# EAGLE design ecg_board (EAGLE 9.6.2)
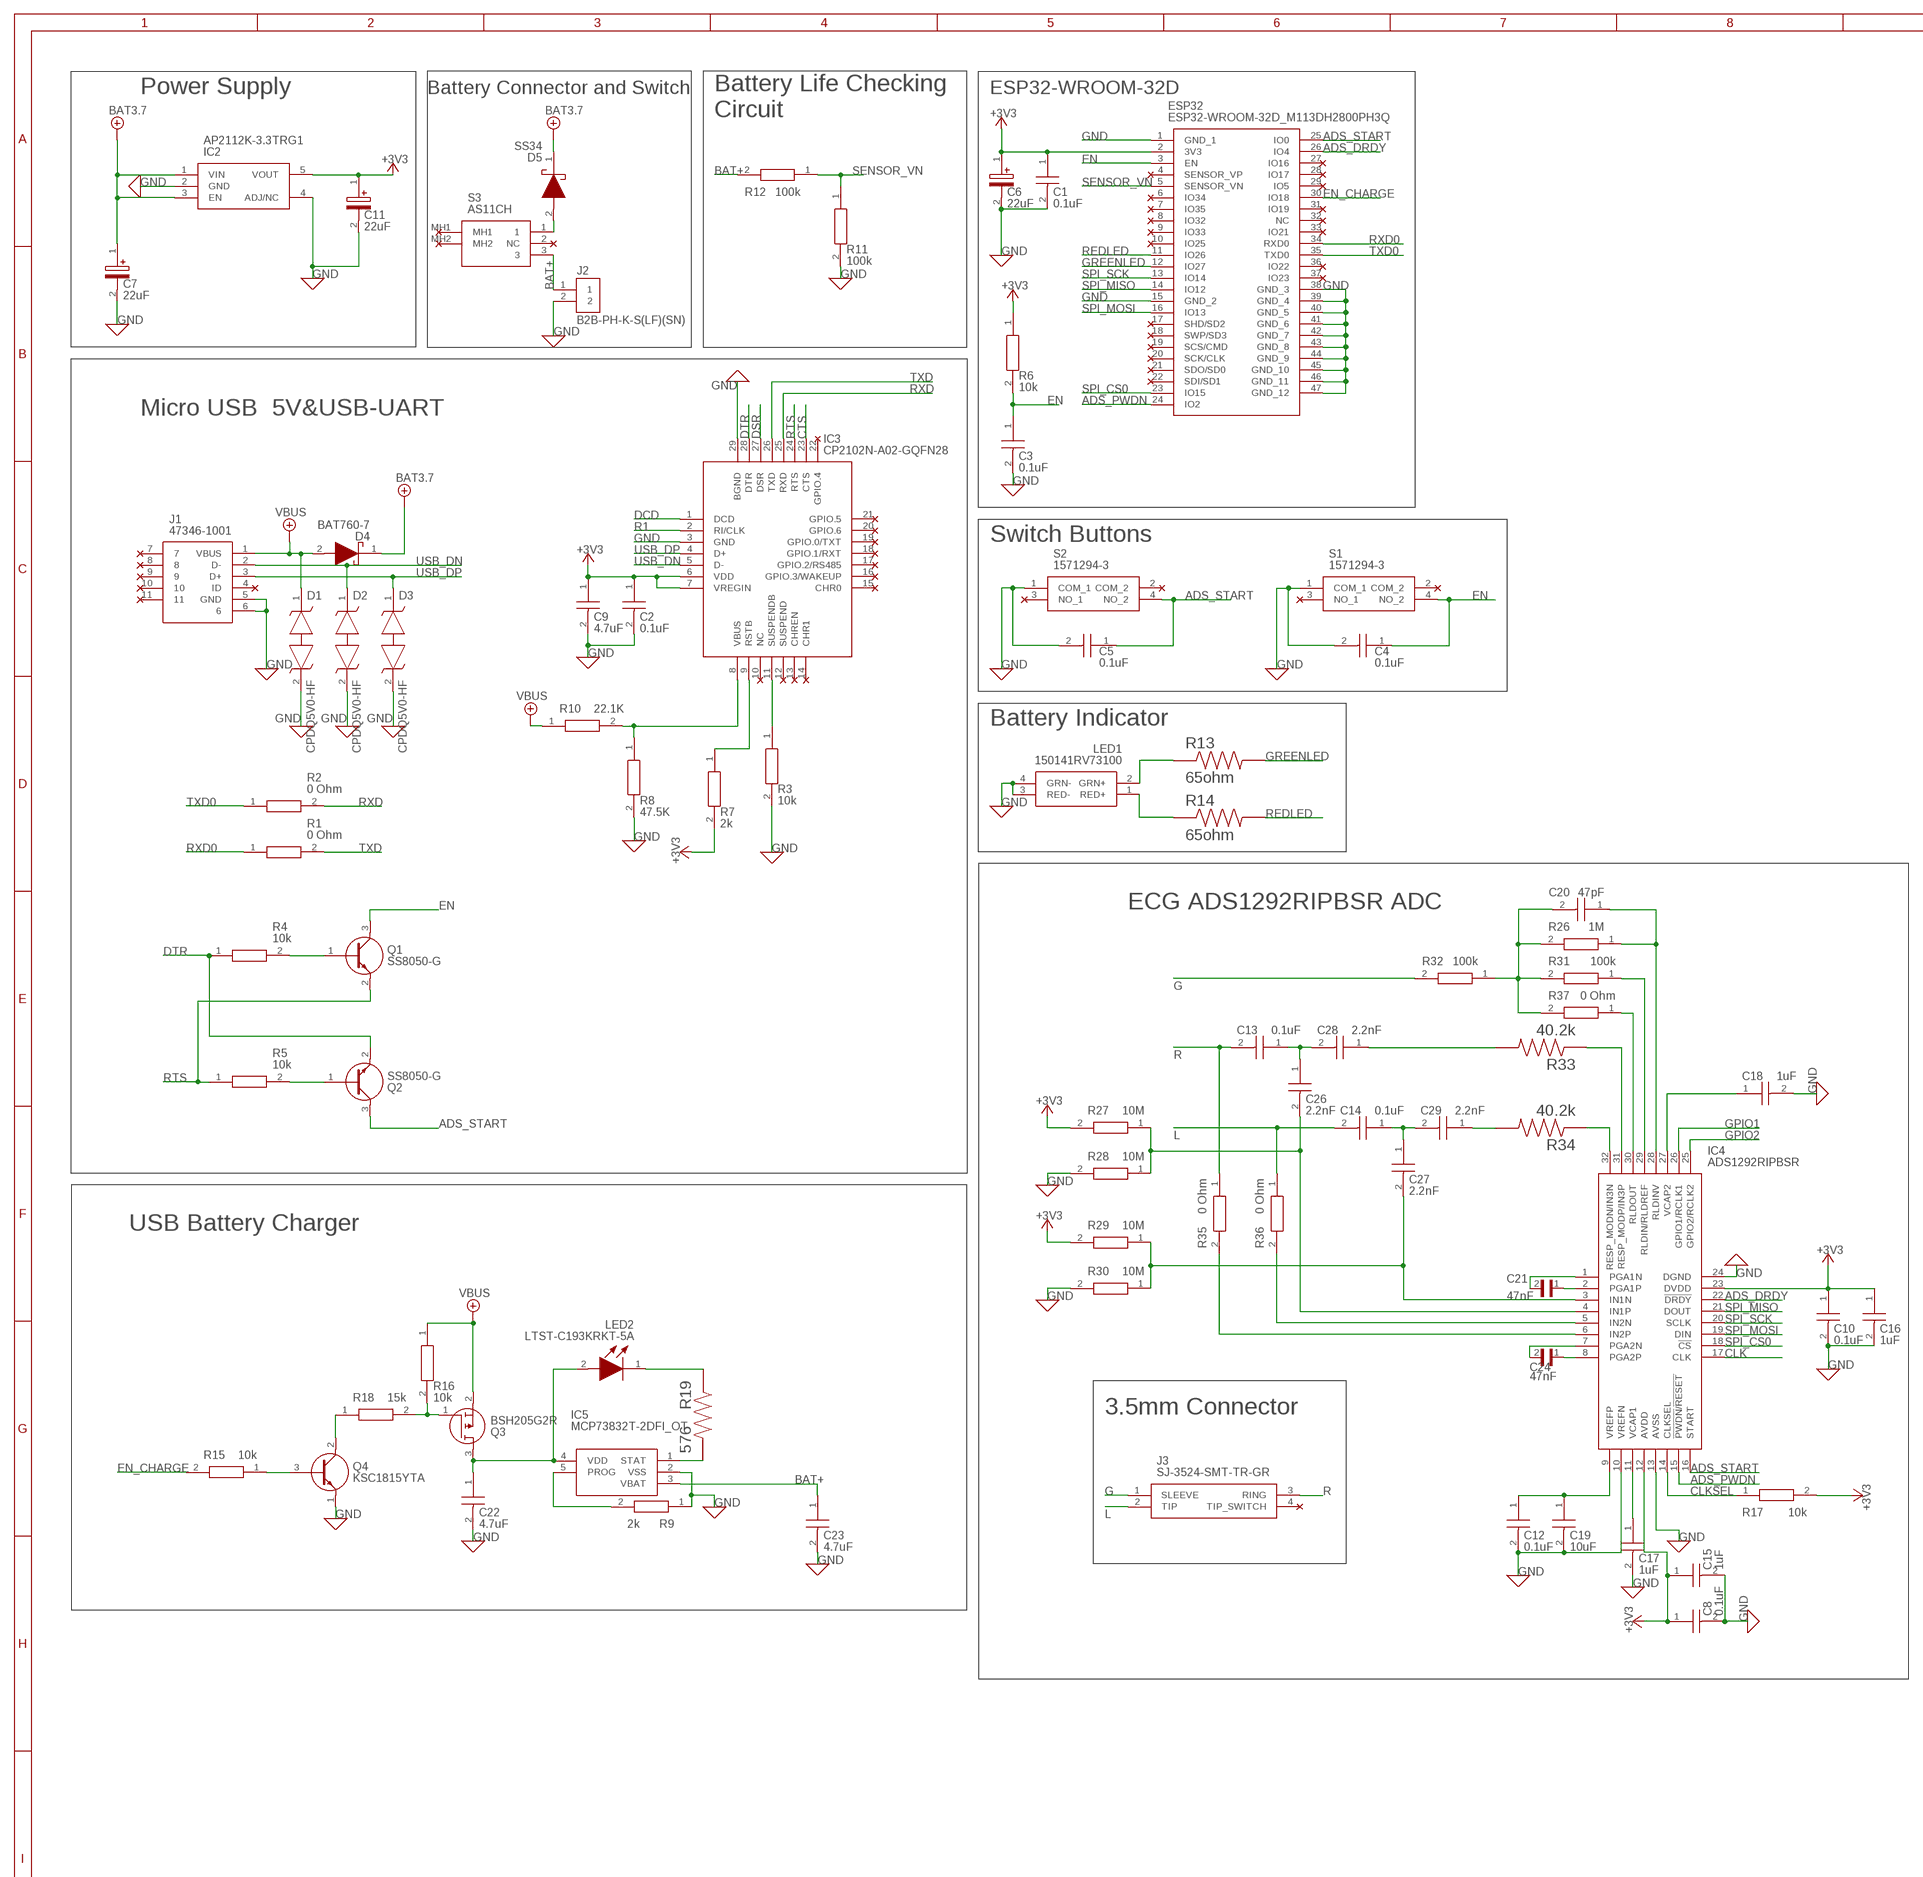
[diagram p0: schematic, sheet 1, part 1 of 2]
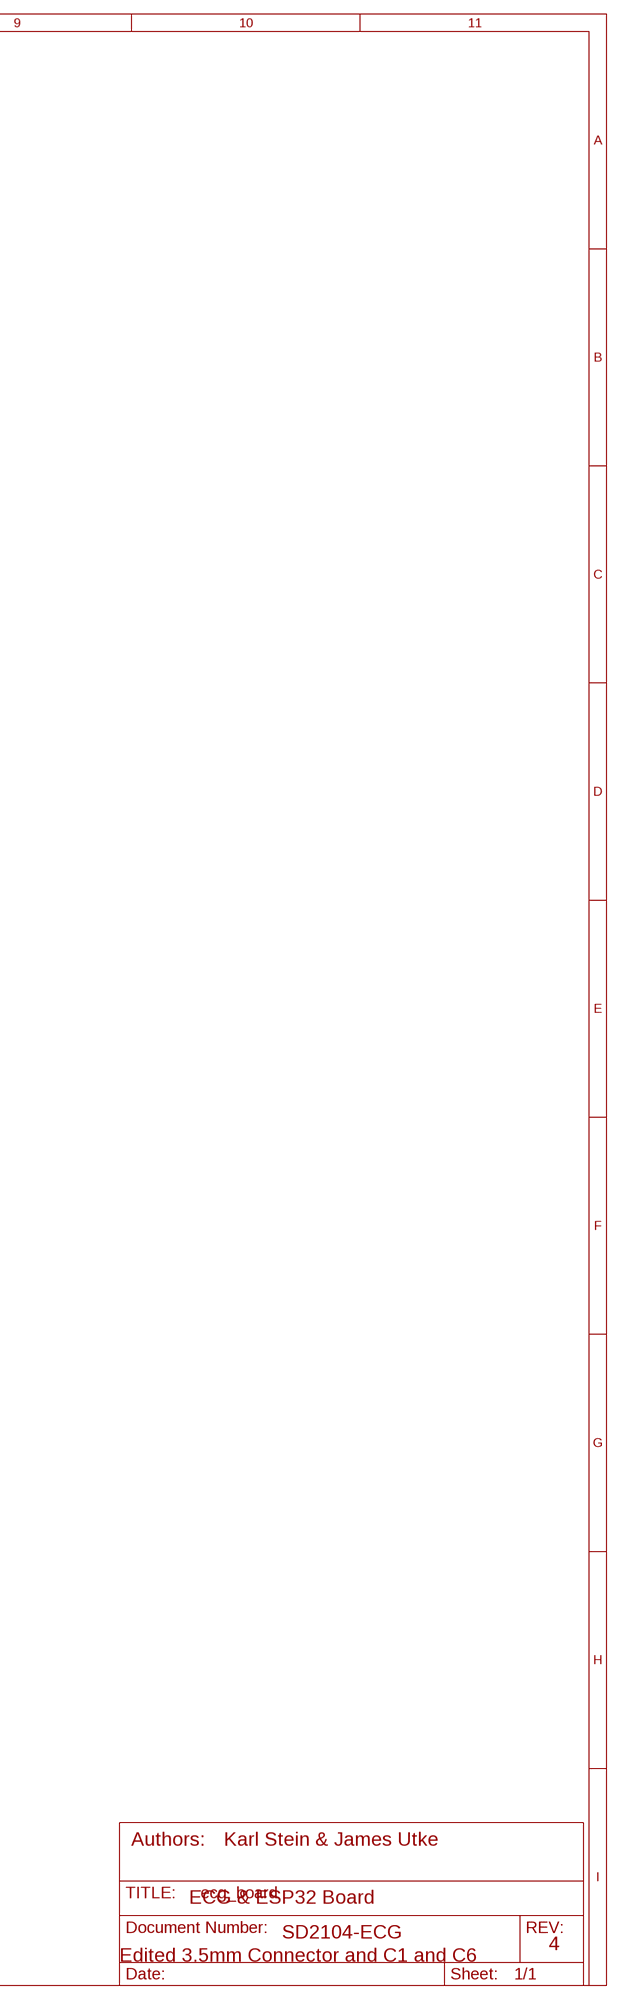
[diagram p1: schematic, sheet 1, part 2 of 2]

## Parts
C1  0.1uF  C0805C104K5RAC7411  [CAPC2012X88N]
C2  0.1uF  C0805C104K5RAC7411  [CAPC2012X88N]
C3  0.1uF  C0805C104K5RAC7411  [CAPC2012X88N]
C4  0.1uF  C0805C104K5RAC7411  [CAPC2012X88N]
C5  0.1uF  C0805C104K5RAC7411  [CAPC2012X88N]
C6  22uF  F381A226MMAAXE  [CAPPC1609X90N]
C7  22uF  F381A226MMAAXE  [CAPPC1609X90N]
C8  0.1uF  C0805C104K5RAC7411  [CAPC2012X88N]
C9  4.7uF  JMK212B7475KGHT  [CAPC2114X145N]
C10  0.1uF  C0805C104K5RAC7411  [CAPC2012X88N]
C11  22uF  F381A226MMAAXE  [CAPPC1609X90N]
C12  0.1uF  C0805C104K5RAC7411  [CAPC2012X88N]
C13  0.1uF  C0805C104K5RAC7411  [CAPC2012X88N]
C14  0.1uF  C0805C104K5RAC7411  [CAPC2012X88N]
C15  1uF  C0805X105K8RAC7210  [CAPC2012X100N]
C16  1uF  C0805X105K8RAC7210  [CAPC2012X100N]
C17  1uF  C0805X105K8RAC7210  [CAPC2012X100N]
C18  1uF  C0805X105K8RAC7210  [CAPC2012X100N]
C19  10uF  TMK212BBJ106MGHT  [CAPC2012X135N]
C20  47pF  CBR08C470J5GAC  [CAPC2012X95N]
C21  47nF  C0805C473K1RECAUTO  [CAPC2012X140N]
C22  4.7uF  JMK212B7475KGHT  [CAPC2114X145N]
C23  4.7uF  JMK212B7475KGHT  [CAPC2114X145N]
C24  47nF  C0805C473K1RECAUTO  [CAPC2012X140N]
C26  2.2nF  C0805J222K1RACAUTO  [CAPC2012X100N]
C27  2.2nF  C0805J222K1RACAUTO  [CAPC2012X100N]
C28  2.2nF  C0805J222K1RACAUTO  [CAPC2012X100N]
C29  2.2nF  C0805J222K1RACAUTO  [CAPC2012X100N]
D1  CPDQ5V0-HF  [SODFL1006X40N]
D2  CPDQ5V0-HF  [SODFL1006X40N]
D3  CPDQ5V0-HF  [SODFL1006X40N]
D4  BAT760-7  [SOD2513X120N]
D5  SS34  [DIOM8059X256N]
ESP32  ESP32-WROOM-32D_M113DH2800PH3Q  [ESP32WROOM32DM113DH2800PH3Q0]
IC2  AP2112K-3.3TRG1  [SOT95P282X130-5N]
IC3  CP2102N-A02-GQFN28  [QFN50P500X500X80-29N]
IC4  ADS1292RIPBSR  [QFP50P700X700X120-32N]
IC5  MCP73832T-2DFI_OT  [SOT95P270X145-5N]
J1  47346-1001  [473461001]
J2  B2B-PH-K-S(LF)(SN)  [JST_B2B-PH-K-S(LF)(SN)]
J3  SJ-3524-SMT-TR-GR  [SJ3524SMTTRGR]
LED1  150141RV73100  [SMD3528_1]
LED2  LTST-C193KRKT-5A  [LEDC1608X45N]
Q1  SS8050-G  [SOT95P240X115-3N]
Q2  SS8050-G  [SOT95P240X115-3N]
Q3  BSH205G2R  [SOT95P230X110-3N]
Q4  KSC1815YTA  [BC33740TA]
R1  0 Ohm  CR0603AJ_-000ELF  [RESC1608X55N]
R2  0 Ohm  CR0603AJ_-000ELF  [RESC1608X55N]
R3  10k  HV73V1JTTD103J  [CAPC1608X55N]
R4  10k  HV73V1JTTD103J  [CAPC1608X55N]
R5  10k  HV73V1JTTD103J  [CAPC1608X55N]
R6  10k  HV73V1JTTD103J  [CAPC1608X55N]
R7  2k  ERJ-UP3F2001V  [RESC1608X55N]
R8  47.5K  ERJ-UP3F4752V  [RESC1608X55N]
R9  2k  ERJ-UP3F2001V  [RESC1608X55N]
R10  22.1K  ERJ-2RHD2212X  [RESC1005X40N]
R11  100k  RCG0603100KJNEA  [RESC1608X50N]
R12  100k  RCG0603100KJNEA  [RESC1608X50N]
R13  65ohm  Y402265R0000A9W  [RESC2012X64N]
R14  65ohm  Y402265R0000A9W  [RESC2012X64N]
R15  10k  HV73V1JTTD103J  [CAPC1608X55N]
R16  10k  HV73V1JTTD103J  [CAPC1608X55N]
R17  10k  HV73V1JTTD103J  [CAPC1608X55N]
R18  15k  CRCW080515K0FKEBC  [RESC2012X60N]
R19  576  CRCW0805576RFKEA  [RESC2012X50N]
R26  1M  HV731JTTD105J  [RESC1608X55N]
R27  10M  CRCW060310M0JNEAC  [RESC1608X55N]
R28  10M  CRCW060310M0JNEAC  [RESC1608X55N]
R29  10M  CRCW060310M0JNEAC  [RESC1608X55N]
R30  10M  CRCW060310M0JNEAC  [RESC1608X55N]
R31  100k  RCG0603100KJNEA  [RESC1608X50N]
R32  100k  RCG0603100KJNEA  [RESC1608X50N]
R33  40.2k  RMCF1206FT40K2  [RESC3216X70N]
R34  40.2k  RMCF1206FT40K2  [RESC3216X70N]
R35  0 Ohm  CR0603AJ_-000ELF  [RESC1608X55N]
R36  0 Ohm  CR0603AJ_-000ELF  [RESC1608X55N]
R37  0 Ohm  CR0603AJ_-000ELF  [RESC1608X55N]
S1  1571294-3  [15712943]
S2  1571294-3  [15712943]
S3  AS11CH  [AS11CH]

## Nets
+3V3: C1.1 C2.1 C6.1(+) C8.1 C9.1 C10.1 C11.1(+) C15.1 C16.1 ESP32.2(3V3) IC2.5(VOUT) IC3.6(VDD) IC3.7(VREGIN) IC4.12(AVDD) IC4.23(DVDD) R6.1 R7.2 R17.2 R27.2 R29.2
+5V: C7.1(+) D4.1(K) D5.1(K) IC2.1(VIN) IC2.3(EN) ; supply symbol labelled BAT3.7
+5V/1: D1.1 D4.2(A) J1.1(VBUS) Q3.2(S) R10.1 R16.1 ; supply symbol labelled VBUS
ADS_DRDY: ESP32.26(IO4) IC4.22(!DRDY)
ADS_PWDN: ESP32.24(IO2) IC4.15(!PWDN!/!RESET)
ADS_START: C5.1 ESP32.25(IO0) IC4.16(START) Q2.3(C) S2.4(NO_2)
BAT+: C23.1 IC5.3(VBAT) J2.1 R12.2 S3.3
CLK: IC4.17(CLK)
CLKSEL: IC4.14(CLKSEL) R17.1
CTS: IC3.23(CTS)
DCD: IC3.1(DCD)
DSR: IC3.27(DSR)
DTR: IC3.28(DTR) Q2.2(E) R4.1
EN: C3.1 C4.1 ESP32.3(EN) Q1.3(C) R6.2 S1.4(NO_2)
EN_CHARGE: ESP32.30(IO18) R15.2
G: J3.1(SLEEVE) R32.2
GND: C1.2 C2.2 C3.2 C4.2 C5.2 C6.2(-) C7.2(-) C8.2 C9.2 C10.2 C11.2(-) C12.2 C15.2 C16.2 C17.2 C18.2 C19.2 C22.2 C23.2 D1.2 D2.2 D3.2 ESP32.1(GND_1) ESP32.15(GND_2) ESP32.38(GND_3) ESP32.39(GND_4) ESP32.40(GND_5) ESP32.41(GND_6) ESP32.42(GND_7) ESP32.43(GND_8) ESP32.44(GND_9) ESP32.45(GND_10) ESP32.46(GND_11) ESP32.47(GND_12) IC2.2(GND) IC2.4(ADJ/NC) IC3.3(GND) IC3.29(BGND) IC4.10(VREFN) IC4.13(AVSS) IC4.24(DGND) IC5.2(VSS) J1.5(GND) J1.6 J2.2 LED1.3(RED-) LED1.4(GRN-) Q4.1(E) R3.2 R8.2 R9.1 R11.2 R28.2 R30.2 S1.1(COM_1) S2.1(COM_1)
GPIO1: IC4.26(GPIO1/RCLK1)
GPIO2: IC4.25(GPIO2/RCLK2)
GREENLED: ESP32.12(IO27) R13.2
L: C14.2 J3.2(TIP) R36.1
N$1: LED1.2(GRN+) R13.1
N$2: LED1.1(RED+) R14.1
N$3: C12.1 C19.1 IC4.9(VREFP)
N$4: Q1.1(B) R4.2
N$5: Q2.1(B) R5.2
N$6: C17.1 IC4.11(VCAP1)
N$7: C18.1 IC4.27(VCAP2)
N$8: LED2.1(K) R19.1
N$9: IC4.32(RESP_MODN/IN3N) R34.1
N$10: D5.2(A) S3.1
N$11: IC5.5(PROG) R9.2
N$12: Q4.3(B) R15.1
N$13: IC4.31(RESP_MODP/IN3P) R33.1
N$14: Q4.2(C) R18.1
N$15: C29.1 R34.2
N$16: IC3.11(SUSPENDB) R3.1
N$17: IC3.9(RSTB) R7.1
N$18: IC3.8(VBUS) R8.1 R10.2
N$20: C14.1 C27.1 C29.2
N$21: C13.1 C26.1 C28.2
N$22: C28.1 R33.2
N$23: IC4.5(IN2N) R36.2
N$24: IC4.6(IN2P) R35.2
N$25: Q3.1(G) R16.2 R18.2
N$26: IC5.1(STAT) R19.2
N$27: C20.2 R26.2 R31.2 R32.1 R37.2
N$28: C22.1 IC5.4(VDD) LED2.2(A) Q3.3(D)
N$42: C21.1 IC4.2(PGA1P)
N$44: C21.2 IC4.1(PGA1N)
N$46: C27.2 IC4.3(IN1N) R29.1 R30.1
N$47: C26.2 IC4.4(IN1P) R27.1 R28.1
N$48: C24.1 IC4.8(PGA2P)
N$49: C24.2 IC4.7(PGA2N)
N$56: IC4.29(RLDIN/RLDREF) R31.1
N$57: IC4.30(RLDOUT) R37.1
N$59: C20.1 IC4.28(RLDINV) R26.1
R: C13.2 J3.3(RING) R35.1
R1: IC3.2(RI/CLK)
REDLED: ESP32.11(IO26) R14.2
RTS: IC3.24(RTS) Q1.2(E) R5.1
RXD: IC3.25(RXD) R2.2
RXD0: ESP32.34(RXD0) R1.1
SENSOR_VN: ESP32.5(SENSOR_VN) R11.1 R12.1
SPI_CS0: ESP32.23(IO15) IC4.18(!CS)
SPI_MISO: ESP32.14(IO12) IC4.21(DOUT)
SPI_MOSI: ESP32.16(IO13) IC4.19(DIN)
SPI_SCK: ESP32.13(IO14) IC4.20(SCLK)
TXD: IC3.26(TXD) R1.2
TXD0: ESP32.35(TXD0) R2.1
USB_DN: D2.1 IC3.5(D-) J1.2(D-)
USB_DP: D3.1 IC3.4(D+) J1.3(D+)
Unconnected: ESP32.4(SENSOR_VP) ESP32.6(IO34) ESP32.7(IO35) ESP32.8(IO32) ESP32.9(IO33) ESP32.10(IO25) ESP32.17(SHD/SD2) ESP32.18(SWP/SD3) ESP32.19(SCS/CMD) ESP32.20(SCK/CLK) ESP32.21(SDO/SD0) ESP32.22(SDI/SD1) ESP32.27(IO16) ESP32.28(IO17) ESP32.29(IO5) ESP32.31(IO19) ESP32.32(NC) ESP32.33(IO21) ESP32.36(IO22) ESP32.37(IO23) IC3.10(NC) IC3.12(SUSPEND) IC3.13(CHREN) IC3.14(CHR1) IC3.15(CHR0) IC3.16(GPIO.3/WAKEUP) IC3.17(GPIO.2/RS485) IC3.18(GPIO.1/RXT) IC3.19(GPIO.0/TXT) IC3.20(GPIO.6) IC3.21(GPIO.5) IC3.22(GPIO.4) J1.4(ID) J1.7 J1.8 J1.9 J1.10 J1.11 J3.4(TIP_SWITCH) S1.2(COM_2) S1.3(NO_1) S2.2(COM_2) S2.3(NO_1) S3.2(NC) S3.MH1 S3.MH2

## Notes on the sheet
- Power Supply | Battery Connector and Switch | ESP32-WROOM-32D
- Battery Life Checking 
  Circuit
- Micro USB  5V&USB-UART
- Switch Buttons
- Battery Indicator
- ECG ADS1292RIPBSR ADC
- USB Battery Charger
- 3.5mm Connector
- Authors: | Karl Stein & James Utke
- ECG & ESP32 Board
- SD2104-ECG
- 4
- Edited 3.5mm Connector and C1 and C6

## Library data of the parts
C1-C5 C8 C10 C12-C14 = SamacSys_Parts:C0805C104K5RAC7411: Cap Ceramic 0.1uF 50V X7R 10% Pad SMD 0805 125C T/R Source: Datasheet; DESCRIPTION: Cap Ceramic 0.1uF 50V X7R 10% Pad SMD 0805 125C T/R; HEIGHT: 0.88mm; MANUFACTURER_NAME: Kemet; MANUFACTURER_PART_NUMBER: C0805C104K5RAC7411; MOUSER_PART_NUMBER: 80-C0805C104K5RACLR; MOUSER_PRICE-STOCK: https://www.mouser.co.uk/ProductDetail/KEMET/C0805C104K5RAC7411/?qs=jbRM9o5BbzPcVXF0wW9AYg%3D%3D
C6 C7 C11 = SamacSys_Parts:F381A226MMAAXE: 22uF F38 Series Conductive Polymer, Miniature, Undertab Solid Electrolytic Chip Capacitors Source: Datasheet <https://componentsearchengine.com/Datasheets/1/F381A226MMAAXE.pdf>; DESCRIPTION: 22uF F38 Series Conductive Polymer, Miniature, Undertab Solid Electrolytic Chip Capacitors; HEIGHT: 0.9mm; MANUFACTURER_NAME: AVX; MANUFACTURER_PART_NUMBER: F381A226MMAAXE; MOUSER_PART_NUMBER: 581-F381A226MMAAXE; MOUSER_PRICE-STOCK: https://www.mouser.co.uk/ProductDetail/AVX/F381A226MMAAXE?qs=gTYE2QTfZfQFi8JvXKXiKg%3D%3D
C9 C22 C23 = SamacSys_Parts:JMK212B7475KGHT: Taiyo Yuden JMK212B7475KGHT 4.7F MLCC 6.3V dc +/-10% Tolerance SMD Source: Datasheet; DESCRIPTION: Taiyo Yuden JMK212B7475KGHT 4.7F MLCC 6.3V dc +/-10% Tolerance SMD; HEIGHT: 1.45mm; MANUFACTURER_NAME: TAIYO YUDEN; MANUFACTURER_PART_NUMBER: JMK212B7475KGHT; MOUSER_PART_NUMBER: 963-JMK212B7475KGHT; MOUSER_PRICE-STOCK: https://www.mouser.co.uk/ProductDetail/Taiyo-Yuden/JMK212B7475KGHT/?qs=vmHwEFxEFR9NgetR%2FORAvw%3D%3D
C15-C18 = SamacSys_Parts:C0805X105K8RAC7210: Multilayer Ceramic Capacitors MLCC - SMD/SMT 10V 1uF X7R 0805 10% Flex Source: Datasheet; DESCRIPTION: Multilayer Ceramic Capacitors MLCC - SMD/SMT 10V 1uF X7R 0805 10% Flex; HEIGHT: 1mm; MANUFACTURER_NAME: Kemet; MANUFACTURER_PART_NUMBER: C0805X105K8RAC7210; MOUSER_PART_NUMBER: 80-C0805X105K8RACLR; MOUSER_PRICE-STOCK: https://www.mouser.co.uk/ProductDetail/KEMET/C0805X105K8RAC7210?qs=ds50AKTGxA8Ac4j4qbsB5A%3D%3D
C19 = SamacSys_Parts:TMK212BBJ106MGHT: Multilayer Ceramic Capacitors MLCC - SMD/SMT CAP ,MLCC ,0805,25V ,X5R,10uF 20% ,T&R Source: Datasheet <https://componentsearchengine.com/Datasheets/1/TMK212BBJ106MGHT.pdf>; DESCRIPTION: Multilayer Ceramic Capacitors MLCC - SMD/SMT CAP ,MLCC ,0805,25V ,X5R,10uF 20% ,T&R; HEIGHT: 1.35mm; MANUFACTURER_NAME: TAIYO YUDEN; MANUFACTURER_PART_NUMBER: TMK212BBJ106MGHT; MOUSER_PART_NUMBER: 963-TMK212BBJ106MGHT; MOUSER_PRICE-STOCK: https://www.mouser.co.uk/ProductDetail/Taiyo-Yuden/TMK212BBJ106MGHT?qs=sBf%2Fb4nBSlfab8x4Ir6OCA%3D%3D
C20 = SamacSys_Parts:CBR08C470J5GAC: Multilayer Ceramic Capacitors MLCC - SMD/SMT 50V 47pF C0G 0805 5% Source: Datasheet <http://www.kemet.com/Lists/ProductCatalog/Attachments/490/KEM_C1030_CBR_SMD.pdf>; DESCRIPTION: Multilayer Ceramic Capacitors MLCC - SMD/SMT 50V 47pF C0G 0805 5%; HEIGHT: 0.95mm; MANUFACTURER_NAME: Kemet; MANUFACTURER_PART_NUMBER: CBR08C470J5GAC; MOUSER_PART_NUMBER: 80-CBR08C470J5GAC; MOUSER_PRICE-STOCK: https://www.mouser.co.uk/ProductDetail/KEMET/CBR08C470J5GAC?qs=3SGS%2FGl3GGxvjRSwA4%2FCFQ%3D%3D
C21 C24 = C0805C473K1RECAUTO:C0805C473K1RECAUTO; DESCRIPTION: CAP CER 0805 47NF 100V X7R 10%; DIGI-KEY_PART_NUMBER: 399-C0805C473K1RECAUTOCT-ND; MF: KEMET; MP: C0805C473K1RECAUTO; PACKAGE: 2012 KEMET; PURCHASE-URL: https://pricing.snapeda.com/search/part/C0805C473K1RECAUTO/?ref=eda
C26-C29 = SamacSys_Parts:C0805J222K1RACAUTO: Multilayer Ceramic Capacitors MLCC - SMD/SMT 100V 2200pF X7R AUTO 10% Open Mode Flex Source: Datasheet <https://4donline.ihs.com/images/VipMasterIC/IC/KEME/KEMES11130/KEMES11130-1.pdf?hkey=EF798316E3902B6ED9A73243A3159BB0>; DESCRIPTION: Multilayer Ceramic Capacitors MLCC - SMD/SMT 100V 2200pF X7R AUTO 10% Open Mode Flex; HEIGHT: 1mm; MANUFACTURER_NAME: Kemet; MANUFACTURER_PART_NUMBER: C0805J222K1RACAUTO; MOUSER_PART_NUMBER: 80-C0805J222K1RAUTO; MOUSER_PRICE-STOCK: https://www.mouser.co.uk/ProductDetail/KEMET/C0805J222K1RACAUTO?qs=ds50AKTGxA8FpM89MhHcBQ%3D%3D
D1-D3 = SamacSys_Parts:CPDQ5V0-HF: ESD Suppressors / TVS Diodes SMD ESD Diode 5V Bi-Direction Source: Datasheet <http://www.comchiptech.com/cms/UserFiles/CPDQ5V0-HF RevA825126.pdf>; DESCRIPTION: ESD Suppressors / TVS Diodes SMD ESD Diode 5V Bi-Direction; HEIGHT: 0.4mm; MANUFACTURER_NAME: Comchip Technology; MANUFACTURER_PART_NUMBER: CPDQ5V0-HF; MOUSER_PART_NUMBER: 750-CPDQ5V0-HF; MOUSER_PRICE-STOCK: https://www.mouser.co.uk/ProductDetail/Comchip-Technology/CPDQ5V0-HF/?qs=ccyN4P6STah119k8k5VB0Q%3D%3D
D4 = SamacSys_Parts:BAT760-7: Diode Schottky 30V 1A 2Pin SOD323 Diodes Inc BAT760-7, SMT Schottky Diode, 30V 1A, 2-Pin SOD-323 Source: Datasheet <https://www.diodes.com/assets/Datasheets/ds30498.pdf>; DESCRIPTION: Diode Schottky 30V 1A 2Pin SOD323 Diodes Inc BAT760-7, SMT Schottky Diode, 30V 1A, 2-Pin SOD-323; HEIGHT: 1.2mm; MANUFACTURER_NAME: Diodes Inc.; MANUFACTURER_PART_NUMBER: BAT760-7; MOUSER_PART_NUMBER: 621-BAT760-7; MOUSER_PRICE-STOCK: https://www.mouser.co.uk/ProductDetail/Diodes-Incorporated/BAT760-7?qs=JV7lzlMm3yKDDyO09xoRbQ%3D%3D
D5 = SamacSys_Parts:SS34: ON Semi SS34 SMT Schottky Diode, 40V 3A, 2-Pin DO-214AB Source: Datasheet <https://componentsearchengine.com/Datasheets/2/SS34.pdf>; DESCRIPTION: ON Semi SS34 SMT Schottky Diode, 40V 3A, 2-Pin DO-214AB; HEIGHT: 2.56mm; MANUFACTURER_NAME: ON Semiconductor; MANUFACTURER_PART_NUMBER: SS34; MOUSER_PART_NUMBER: 512-SS34; MOUSER_PRICE-STOCK: https://www.mouser.co.uk/ProductDetail/ON-Semiconductor-Fairchild/SS34?qs=2ONuHmP%2FXzb3ub11UdFfdQ%3D%3D
ESP32 = SamacSys_Parts:ESP32-WROOM-32D_M113DH2800PH3Q: WiFi Modules (802.11) SMD Module, ESP32-D0WD, 32Mbits SPI flash, UART mode, PCB antenna Source: Datasheet <https://www.espressif.com/sites/default/files/documentation/esp32-wroom-32d_esp32-wroom-32u_datasheet_en.pdf>; DESCRIPTION: WiFi Modules (802.11) SMD Module, ESP32-D0WD, 32Mbits SPI flash, UART mode, PCB antenna; HEIGHT: 3.2mm; MANUFACTURER_NAME: Espressif Systems; MANUFACTURER_PART_NUMBER: ESP32-WROOM-32D(M113DH2800PH3Q0); MOUSER_PART_NUMBER: 356-ES32WROOM32D16MB; MOUSER_PRICE-STOCK: https://www.mouser.co.uk/ProductDetail/Espressif-Systems/ESP32-WROOM-32DM113DH2800PH3Q0/?qs=W%2FMpXkg%252BdQ75%2Fda1rSxxJw%3D%3D
IC2 = SamacSys_Parts:AP2112K-3.3TRG1: 600mA 3.3V LDO Regulator Enable SOT23-5 DiodesZetex AP2112K-3.3TRG1, LDO Voltage Regulator, 3.3 V +/-1.5%, 2.5 6 Vin, 5-Pin SOT-23 Source: Datasheet; DESCRIPTION: 600mA 3.3V LDO Regulator Enable SOT23-5 DiodesZetex AP2112K-3.3TRG1, LDO Voltage Regulator, 3.3 V +/-1.5%, 2.5 6 Vin, 5-Pin SOT-23; HEIGHT: 1.3mm; MANUFACTURER_NAME: Diodes Inc.; MANUFACTURER_PART_NUMBER: AP2112K-3.3TRG1; MOUSER_PART_NUMBER: 621-AP2112K-3.3TRG1; MOUSER_PRICE-STOCK: https://www.mouser.co.uk/ProductDetail/Diodes-Incorporated/AP2112K-33TRG1/?qs=x6A8l6qLYDDPYHosCdzh%2FA%3D%3D
IC3 = SamacSys_Parts:CP2102N-A02-GQFN28: SILICON LABS - CP2102N-A02-GQFN28 - USB TO UART BRIDGE, -40 TO 85DEG C Source: Datasheet <https://componentsearchengine.com/Datasheets/2/CP2102N-A02-GQFN28.pdf>; DESCRIPTION: SILICON LABS - CP2102N-A02-GQFN28 - USB TO UART BRIDGE, -40 TO 85DEG C; HEIGHT: 0.8mm; MANUFACTURER_NAME: Silicon Labs; MANUFACTURER_PART_NUMBER: CP2102N-A02-GQFN28; MOUSER_PART_NUMBER: 634-CP2102NA02GQFN28; MOUSER_PRICE-STOCK: https://www.mouser.co.uk/ProductDetail/Silicon-Labs/CP2102N-A02-GQFN28/?qs=u16ybLDytRaSBkSkyjYFiA%3D%3D
IC4 = SamacSys_Parts:ADS1292RIPBSR: 2-Channel, 24-Bit Analog-To-Digital Converter w/Integrated Respiration Impedance and ECG Front End Source: Datasheet <http://www.ti.com/lit/gpn/ads1292r>; DESCRIPTION: 2-Channel, 24-Bit Analog-To-Digital Converter w/Integrated Respiration Impedance and ECG Front End; HEIGHT: 1.2mm; MANUFACTURER_NAME: Texas Instruments; MANUFACTURER_PART_NUMBER: ADS1292RIPBSR; MOUSER_PART_NUMBER: 595-ADS1292RIPBSR; MOUSER_PRICE-STOCK: https://www.mouser.co.uk/ProductDetail/Texas-Instruments/ADS1292RIPBSR?qs=i8JZjLRTtkKsg%252Br1%252BHF4jw%3D%3D
IC5 = SamacSys_Parts:MCP73832T-2DFI_OT: Battery Management 4.2V Li-Ion/Li-Poly Chrg mgnt controller Source: Datasheet <http://ww1.microchip.com/downloads/en/DeviceDoc/20001984g.pdf>; DESCRIPTION: Battery Management 4.2V Li-Ion/Li-Poly Chrg mgnt controller; HEIGHT: 1.45mm; MANUFACTURER_NAME: Microchip; MANUFACTURER_PART_NUMBER: MCP73832T-2DFI/OT; MOUSER_PART_NUMBER: 579-MCP73832T2DFI/OT; MOUSER_PRICE-STOCK: https://www.mouser.co.uk/ProductDetail/Microchip-Technology/MCP73832T-2DFI-OT?qs=Of9BA0M78V%2Fd7MaXZyVc5w%3D%3D
J1 = SamacSys_Parts:47346-1001: MOLEX - 47346-1001 - MULTIPOLE CONNECTOR Source: Datasheet <http://www.molex.com/webdocs/datasheets/pdf/en-us/0473461001_IO_CONNECTORS.pdf>; DESCRIPTION: MOLEX - 47346-1001 - MULTIPOLE CONNECTOR; HEIGHT: 2.94mm; MANUFACTURER_NAME: Molex; MANUFACTURER_PART_NUMBER: 47346-1001; MOUSER_PART_NUMBER: 538-47346-1001; MOUSER_PRICE-STOCK: https://www.mouser.co.uk/ProductDetail/Molex/47346-1001/?qs=yd8XiKYcH9muPqUKe4E0Dw%3D%3D
J2 = B2B-PH-K-S_LF__SN_:B2B-PH-K-S(LF)(SN): PH Series 2 Position 2 mm Pitch Through Hole Top Entry Shrouded Header; DESCRIPTION: Connector Header Through Hole 2 position 0.079 (2.00mm); DIGI-KEY_PART_NUMBER: 455-1704-ND; MF: JST Sales; MP: B2B-PH-K-S(LF)(SN); PACKAGE: None; PURCHASE-URL: https://pricing.snapeda.com/search/part/B2B-PH-K-S(LF)(SN)/?ref=eda
J3 = SamacSys_Parts:SJ-3524-SMT-TR-GR: CONN JACK STEREO 3.5MM SMD R/A Source: Datasheet <https://componentsearchengine.com/Datasheets/1/SJ-3524-SMT-TR-GR.pdf>; DESCRIPTION: CONN JACK STEREO 3.5MM SMD R/A; HEIGHT: 5mm; MANUFACTURER_NAME: CUI Inc.; MANUFACTURER_PART_NUMBER: SJ-3524-SMT-TR-GR; MOUSER_PART_NUMBER: 490-SJ3524-SMT-TR-GR; MOUSER_PRICE-STOCK: https://www.mouser.co.uk/ProductDetail/CUI-Devices/SJ-3524-SMT-TR-GR/?qs=WyjlAZoYn529WQTQrqdtvA%3D%3D
LED1 = SamacSys_Parts:150141RV73100: LED,Wurth Elektronik,150141RV73100 Wurth Elektronik 150141RV73100, WL-SBTW Series Bi-colour Green, Red LED, 572 / 625 nm 4-Pin 3528 (1411), Round Lens Source: Datasheet <https://componentsearchengine.com/Datasheets/2/150141RV73100.pdf>; DESCRIPTION: LED,Wurth Elektronik,150141RV73100 Wurth Elektronik 150141RV73100, WL-SBTW Series Bi-colour Green, Red LED, 572 / 625 nm 4-Pin 3528 (1411), Round Lens; HEIGHT: mm; MANUFACTURER_NAME: Wurth Elektronik; MANUFACTURER_PART_NUMBER: 150141RV73100; MOUSER_PART_NUMBER: 710-150141RV73100; MOUSER_PRICE-STOCK: https://www.mouser.co.uk/ProductDetail/Wurth-Elektronik/150141RV73100?qs=LlUlMxKIyB1w9QlMugtMLA%3D%3D
LED2 = SamacSys_Parts:LTST-C193KRKT-5A: Lite-On LTST-C193KRKT-5A, 631 nm Red LED, 1608 (0603) SMD package Source: Datasheet; DESCRIPTION: Lite-On LTST-C193KRKT-5A, 631 nm Red LED, 1608 (0603) SMD package; HEIGHT: 0.45mm; MANUFACTURER_NAME: Lite-On; MANUFACTURER_PART_NUMBER: LTST-C193KRKT-5A; MOUSER_PART_NUMBER: 859-LTSTC193KRKT5A; MOUSER_PRICE-STOCK: https://www.mouser.co.uk/ProductDetail/Lite-On/LTST-C193KRKT-5A/?qs=xIkB7y1OTor17kZSHyF5tQ%3D%3D
Q1 Q2 = SamacSys_Parts:SS8050-G: Bipolar Transistors - BJT NPN TRANSISTOR 1.5A 40V Source: Datasheet <http://www.comchiptech.com/admin/files/product/SS8050-G RevA181526.pdf>; DESCRIPTION: Bipolar Transistors - BJT NPN TRANSISTOR 1.5A 40V; HEIGHT: 1.15mm; MANUFACTURER_NAME: Comchip Technology; MANUFACTURER_PART_NUMBER: SS8050-G; MOUSER_PART_NUMBER: 750-SS8050-G; MOUSER_PRICE-STOCK: https://www.mouser.co.uk/ProductDetail/Comchip-Technology/SS8050-G/?qs=LLUE9lz1YbcHg%252BWLMAtcrQ%3D%3D
Q3 = SamacSys_Parts:BSH205G2R: MOSFET 20V P-channel Trench MOSFET Source: Datasheet <https://assets.nexperia.com/documents/data-sheet/BSH205G2.pdf>; DESCRIPTION: MOSFET 20V P-channel Trench MOSFET; HEIGHT: 1.1mm; MANUFACTURER_NAME: Nexperia; MANUFACTURER_PART_NUMBER: BSH205G2R; MOUSER_PART_NUMBER: 771-BSH205G2R; MOUSER_PRICE-STOCK: https://www.mouser.co.uk/ProductDetail/Nexperia/BSH205G2R?qs=%252BRKXB2WKlScNIfK4SlBmFA%3D%3D
Q4 = SamacSys_Parts:KSC1815YTA: Transistor, Fairchild, KSC1815YTA Source: Datasheet <https://www.onsemi.com/products/discretes-drivers/general-purpose-and-low-vcesat-transistors/ksc1815>; DESCRIPTION: Transistor, Fairchild, KSC1815YTA; HEIGHT: mm; MANUFACTURER_NAME: ON Semiconductor; MANUFACTURER_PART_NUMBER: KSC1815YTA; MOUSER_PART_NUMBER: 512-KSC1815YTA; MOUSER_PRICE-STOCK: https://www.mouser.co.uk/ProductDetail/ON-Semiconductor-Fairchild/KSC1815YTA?qs=ljbEvF4DwOP9FJQWOCoFLQ%3D%3D
R1 R2 R35-R37 = SamacSys_Parts:CR0603AJ_-000ELF: Thick Film Resistors - SMD ResA 0603 0R Jumper 100mW AEC-Q200 Source: Datasheet; DESCRIPTION: Thick Film Resistors - SMD ResA 0603 0R Jumper 100mW AEC-Q200; HEIGHT: 0.55mm; MANUFACTURER_NAME: Bourns; MANUFACTURER_PART_NUMBER: CR0603AJ/-000ELF; MOUSER_PART_NUMBER: 652-CR0603AJ/-000ELF; MOUSER_PRICE-STOCK: https://www.mouser.co.uk/ProductDetail/Bourns/CR0603AJ-000ELF/?qs=GedFDFLaBXF8EepoWODZMQ%3D%3D
R3-R6 R15-R17 = SamacSys_Parts:HV73V1JTTD103J: Thick Film Resistors - SMD 10000Ohms 5% 0603 TCR=100 AEC-Q200 Source: Datasheet; DESCRIPTION: Thick Film Resistors - SMD 10000Ohms 5% 0603 TCR=100 AEC-Q200; HEIGHT: 0.55mm; MANUFACTURER_NAME: KOA Speer; MANUFACTURER_PART_NUMBER: HV73V1JTTD103J; MOUSER_PART_NUMBER: 660-HV73V1JTTD103J; MOUSER_PRICE-STOCK: https://www.mouser.co.uk/ProductDetail/KOA-Speer/HV73V1JTTD103J?qs=xZ%2FP%252Ba9zWqbXuiWLWua7%2Fw%3D%3D
R7 R9 = SamacSys_Parts:ERJ-UP3F2001V: Anti-Sulfurated Thick Film Chip Resistors / Anti-Surge Type Source: Datasheet <https://industrial.panasonic.com/cdbs/www-data/pdf/RDP0000/AOA0000C337.pdf>; DESCRIPTION: Anti-Sulfurated Thick Film Chip Resistors / Anti-Surge Type; HEIGHT: 0.55mm; MANUFACTURER_NAME: Panasonic; MANUFACTURER_PART_NUMBER: ERJ-UP3F2001V
R8 = SamacSys_Parts:ERJ-UP3F4752V: Thick Film Resistors - SMD AEC-Q200 Source: Datasheet; DESCRIPTION: Thick Film Resistors - SMD AEC-Q200; HEIGHT: 0.55mm; MANUFACTURER_NAME: Panasonic; MANUFACTURER_PART_NUMBER: ERJ-UP3F4752V; MOUSER_PART_NUMBER: 667-ERJ-UP3F4752V; MOUSER_PRICE-STOCK: https://www.mouser.co.uk/ProductDetail/Panasonic/ERJ-UP3F4752V?qs=GedFDFLaBXGUd1E4zR%252BF8g%3D%3D
R10 = SamacSys_Parts:ERJ-2RHD2212X: Thick Film Resistors - SMD 0402 Resistor 0.5% 50ppm 22.1KOhm Source: Datasheet; DESCRIPTION: Thick Film Resistors - SMD 0402 Resistor 0.5% 50ppm 22.1KOhm; HEIGHT: 0.4mm; MANUFACTURER_NAME: Panasonic; MANUFACTURER_PART_NUMBER: ERJ-2RHD2212X; MOUSER_PART_NUMBER: 667-ERJ-2RHD2212X; MOUSER_PRICE-STOCK: https://www.mouser.co.uk/ProductDetail/Panasonic/ERJ-2RHD2212X?qs=pfd5qewlna6lhy494ElLrw%3D%3D
R11 R12 R31 R32 = SamacSys_Parts:RCG0603100KJNEA: RCG0603100KJNEA Source: Datasheet <https://componentsearchengine.com/Datasheets/1/RCG0603100KJNEA.pdf>; DESCRIPTION: RCG0603100KJNEA; HEIGHT: 0.5mm; MANUFACTURER_NAME: Vishay; MANUFACTURER_PART_NUMBER: RCG0603100KJNEA; MOUSER_PART_NUMBER: 71-RCG0603100KJNEA; MOUSER_PRICE-STOCK: https://www.mouser.com/Search/Refine.aspx?Keyword=71-RCG0603100KJNEA
R13 R14 = Y402265R0000A9W:Y402265R0000A9W; DESCRIPTION: 65 Ohms ±0.05% 0.2W, 1/5W Chip Resistor 0805 (2012 Metric) Moisture Resistant, Non-Inductive Metal Foil; DIGI-KEY_PART_NUMBER: Y402265R0000A9W-ND; MF: Vishay; MP: Y402265R0000A9W; PACKAGE: 2012 Vishay
R18 = SamacSys_Parts:CRCW080515K0FKEBC: Thick Film Resistors - SMD 1/8Watt 15Kohms 1% Commercial Use Source: Datasheet <http://www.vishay.com/docs/28773/crcwce3.pdf>; DESCRIPTION: Thick Film Resistors - SMD 1/8Watt 15Kohms 1% Commercial Use; HEIGHT: 0.6mm; MANUFACTURER_NAME: Vishay; MANUFACTURER_PART_NUMBER: CRCW080515K0FKEBC; MOUSER_PART_NUMBER: 71-CRCW080515K0FKEBC; MOUSER_PRICE-STOCK: https://www.mouser.co.uk/ProductDetail/Vishay-Dale/CRCW080515K0FKEBC?qs=wd5RIQLrsJhoqkW23VWcpg%3D%3D
R19 = CRCW0805576RFKEA:CRCW0805576RFKEA: RES, THICK FILM, 576R, 1%, 0.125W, 0805; DESCRIPTION: 576 Ohms ±1% 0.125W, 1/8W Chip Resistor 0805 (2012 Metric) Automotive AEC-Q200 Thick Film; DIGI-KEY_PART_NUMBER: 541-576CCT-ND; MF: Vishay; MP: CRCW0805576RFKEA; PACKAGE: 2012 Vishay; PURCHASE-URL: https://pricing.snapeda.com/search/part/CRCW0805576RFKEA/?ref=eda
R26 = SamacSys_Parts:HV731JTTD105J: Thick Film Resistors - SMD 1M OHM 5% 350V Source: Datasheet; DESCRIPTION: Thick Film Resistors - SMD 1M OHM 5% 350V; HEIGHT: 0.55mm; MANUFACTURER_NAME: KOA Speer; MANUFACTURER_PART_NUMBER: HV731JTTD105J
R27-R30 = SamacSys_Parts:CRCW060310M0JNEAC: D11/CRCW0603-C 200 10M 5% ET1 Source: Datasheet <https://componentsearchengine.com/Datasheets/1/CRCW060310M0JNEAC.pdf>; DESCRIPTION: D11/CRCW0603-C 200 10M 5% ET1; HEIGHT: 0.55mm; MANUFACTURER_NAME: Vishay; MANUFACTURER_PART_NUMBER: CRCW060310M0JNEAC; MOUSER_PART_NUMBER: 71-CRCW060310M0JNEAC; MOUSER_PRICE-STOCK: https://www.mouser.com/Search/Refine.aspx?Keyword=71-CRCW060310M0JNEAC
R33 R34 = RMCF1206FT40K2:RMCF1206FT40K2; DESCRIPTION: 40.2 kOhms ±1% 0.25W, 1/4W Chip Resistor 1206 (3216 Metric) Automotive AEC-Q200 Thick Film; DIGI-KEY_PART_NUMBER: RMCF1206FT40K2CT-ND; MF: Stackpole Electronics Inc; MP: RMCF1206FT40K2; PACKAGE: 3216 Stackpole; PURCHASE-URL: https://pricing.snapeda.com/search/part/RMCF1206FT40K2/?ref=eda
S1 S2 = SamacSys_Parts:1571294-3: SWITCH,TACT,SMT,SEALED Source: Datasheet <https://www.te.com/commerce/DocumentDelivery/DDEController?Action=srchrtrv&DocNm=1571294&DocType=Customer Drawing&DocLang=English&PartCntxt=1571294-3&DocFormat=pdf>; DESCRIPTION: SWITCH,TACT,SMT,SEALED; HEIGHT: 5.5mm; MANUFACTURER_NAME: TE Connectivity; MANUFACTURER_PART_NUMBER: 1571294-3; MOUSER_PART_NUMBER: 506-1571294-3; MOUSER_PRICE-STOCK: https://www.mouser.co.uk/ProductDetail/TE-Connectivity-PB/1571294-3/?qs=bkeGI61iuy0TyJA2A0%2FQXg%3D%3D
S3 = SamacSys_Parts:AS11CH: Switch Slide ON None OFF SPST Side Slide 0.1A 28VAC 28VDC 0.4VA 50000Cycles PC Pins Bracket Mount/Through Hole Source: Datasheet <https://componentsearchengine.com/Datasheets/1/AS11CH.pdf>; DESCRIPTION: Switch Slide ON None OFF SPST Side Slide 0.1A 28VAC 28VDC 0.4VA 50000Cycles PC Pins Bracket Mount/Through Hole; HEIGHT: 6.18mm; MANUFACTURER_NAME: NKK Switches; MANUFACTURER_PART_NUMBER: AS11CH; MOUSER_PART_NUMBER: 633-AS11CH; MOUSER_PRICE-STOCK: https://www.mouser.co.uk/ProductDetail/NKK-Switches/AS11CH?qs=MODAV37v1mC%2FcDng1K%2FMsg%3D%3D

## Net classes
0 default: width 0.152 mm
1 Power: width 0.508 mm

## Board
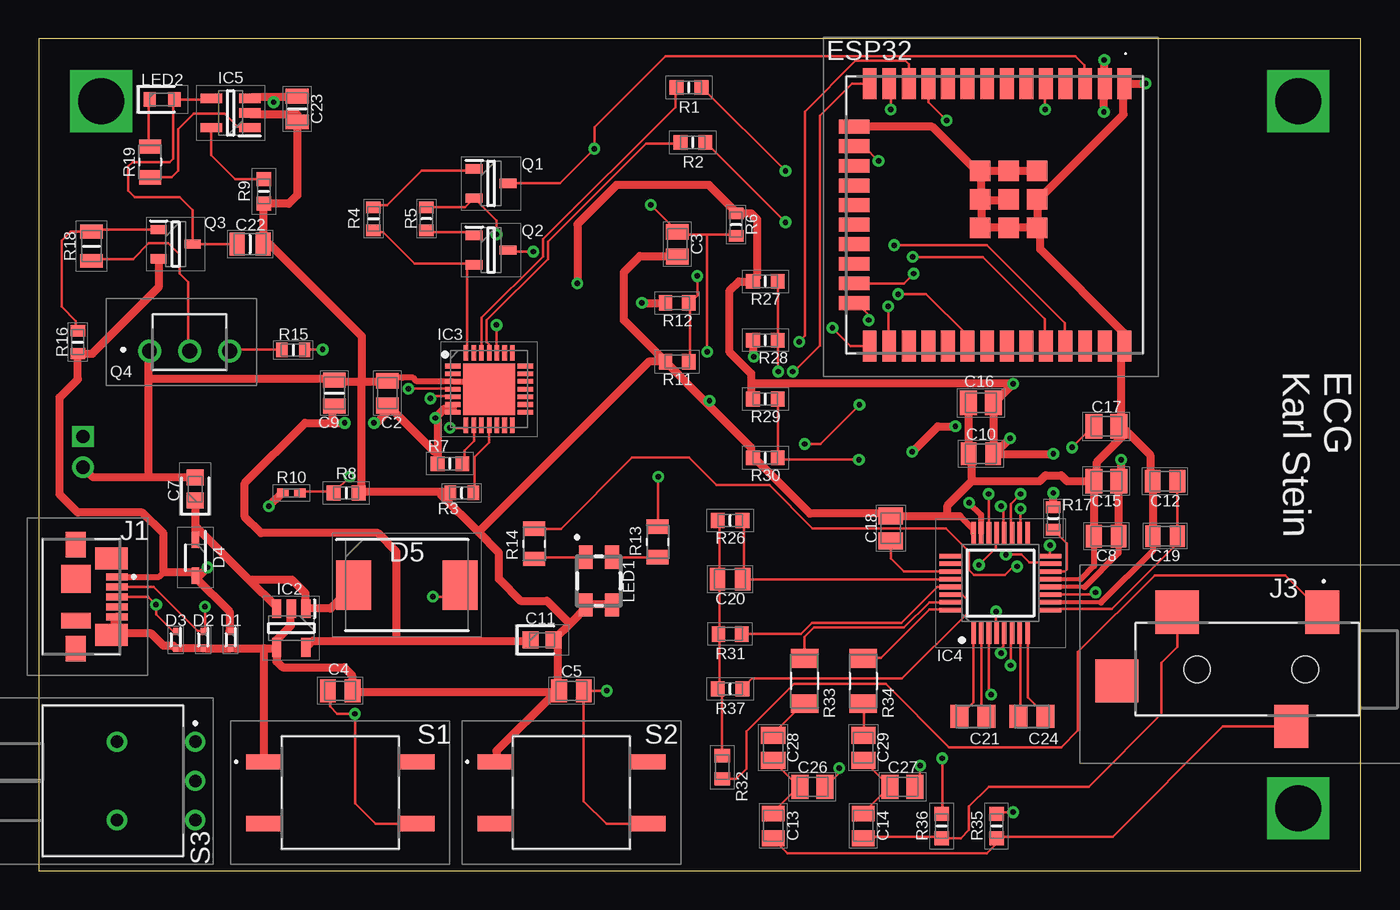
[diagram p2: board, top side]
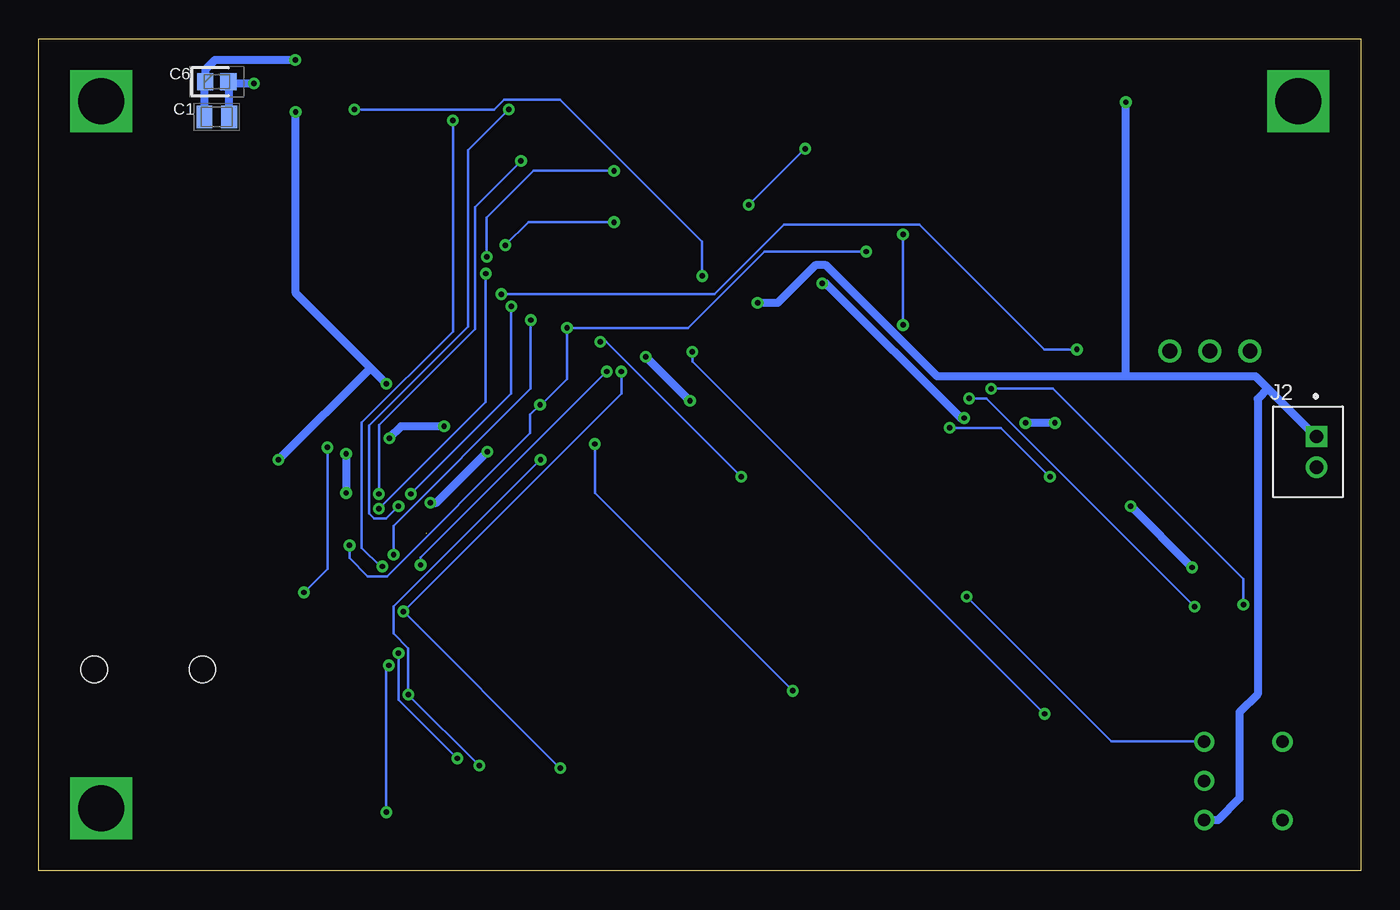
[diagram p3: board, bottom side, seen from below]

Size 85.72 x 53.98 mm. Coordinates in mm from the lower left corner, seen from the top.
Outline: 0,0 85.72,0 85.72,53.98 0,53.98 0,0
Copper layers (1*16): Top 0.035mm / dielectric 1.5mm / Bottom 0.035mm
Design rules "default": minimum track width 6mil, minimum drill 0.35mm, track to track 6mil, track to pad 6mil, pad to pad 6mil, via to via 6mil, smd to smd 6mil, copper to edge 40mil, drill to drill 6mil, minimum pad ring 10mil, minimum via ring 8mil, stop-mask expansion 4mil, vias tented up to drill 0mil, thermal gap 10mil

### Footprints (pad centres in the part's own frame; a part is rotated, then mirrored left to right if it is on the bottom)
CAPC2012X88N = smd 1.02 x 1.47: 1 -0.8,0; 2 0.8,0
CAPPC1609X90N = smd 1.05 x 1.1: 1 -0.75,0; 2 0.75,0
CAPC2114X145N = smd 0.96 x 1.49: 1 -0.84,0; 2 0.84,0
CAPC2012X100N = smd 1.1 x 1.57: 1 -0.81,0; 2 0.81,0
CAPC2012X135N = smd 0.96 x 1.39: 1 -0.79,0; 2 0.79,0
CAPC2012X95N = smd 0.99 x 1.47: 1 -0.82,0; 2 0.82,0
CAPC2012X140N = smd 1.16 x 1.47: 1 -0.875,0; 2 0.875,0
SODFL1006X40N = smd 0.43 x 0.32: 1 -0.55,0; 2 0.55,0
SOD2513X120N = smd 1.075 x 0.5: 1 -1.162,0; 2 1.162,0
DIOM8059X256N = smd 2.25 x 3.2: 1 -3.45,0; 2 3.45,0
ESP32WROOM32DM113DH2800PH3Q0 = smd 2 x 0.9: 1 -8.5,8.41; 2 -8.5,7.14; 3 -8.5,5.87; 4 -8.5,4.6; 5 -8.5,3.33; 6 -8.5,2.06; 7 -8.5,0.79; 8 -8.5,-0.48; 9 -8.5,-1.75; 10 -8.5,-3.02; 11 -8.5,-4.29; 12 -8.5,-5.56; 13 -8.5,-6.83; 14 -8.5,-8.1; 25 8.5,-8.1; 26 8.5,-6.83; 27 8.5,-5.56; 28 8.5,-4.29; 29 8.5,-3.02; 30 8.5,-1.75; 31 8.5,-0.48; 32 8.5,0.79; 33 8.5,2.06; 34 8.5,3.33; 35 8.5,4.6; 36 8.5,5.87; 37 8.5,7.14; 38 8.5,8.41 | smd 0.9 x 2: 15 -5.715,-9.1; 16 -4.445,-9.1; 17 -3.175,-9.1; 18 -1.905,-9.1; 19 -0.635,-9.1; 20 0.635,-9.1; 21 1.905,-9.1; 22 3.175,-9.1; 23 4.445,-9.1; 24 5.715,-9.1 | smd 1.33 x 1.33: 39 -2.835,2.745; 40 -1,2.745; 41 0.835,2.745; 42 -2.835,0.91; 43 -1,0.91; 44 0.835,0.91; 45 -2.835,-0.925; 46 -1,-0.925; 47 0.835,-0.925
SOT95P282X130-5N = smd 1.2 x 0.6: 1 -1.25,0.95; 2 -1.25,0; 3 -1.25,-0.95; 4 1.25,-0.95; 5 1.25,0.95
QFN50P500X500X80-29N = smd 1 x 0.3: 1 -2.35,1.5; 2 -2.35,1; 3 -2.35,0.5; 4 -2.35,0; 5 -2.35,-0.5; 6 -2.35,-1; 7 -2.35,-1.5; 15 2.35,-1.5; 16 2.35,-1; 17 2.35,-0.5; 18 2.35,0; 19 2.35,0.5; 20 2.35,1; 21 2.35,1.5 | smd 0.3 x 1: 8 -1.5,-2.35; 9 -1,-2.35; 10 -0.5,-2.35; 11 0,-2.35; 12 0.5,-2.35; 13 1,-2.35; 14 1.5,-2.35; 22 1.5,2.35; 23 1,2.35; 24 0.5,2.35; 25 0,2.35; 26 -0.5,2.35; 27 -1,2.35; 28 -1.5,2.35 | smd 3.35 x 3.35: 29 0,0
QFP50P700X700X120-32N = smd 1.45 x 0.3: 1 -3.225,1.75; 2 -3.225,1.25; 3 -3.225,0.75; 4 -3.225,0.25; 5 -3.225,-0.25; 6 -3.225,-0.75; 7 -3.225,-1.25; 8 -3.225,-1.75; 17 3.225,-1.75; 18 3.225,-1.25; 19 3.225,-0.75; 20 3.225,-0.25; 21 3.225,0.25; 22 3.225,0.75; 23 3.225,1.25; 24 3.225,1.75 | smd 0.3 x 1.45: 9 -1.75,-3.225; 10 -1.25,-3.225; 11 -0.75,-3.225; 12 -0.25,-3.225; 13 0.25,-3.225; 14 0.75,-3.225; 15 1.25,-3.225; 16 1.75,-3.225; 25 1.75,3.225; 26 1.25,3.225; 27 0.75,3.225; 28 0.25,3.225; 29 -0.25,3.225; 30 -0.75,3.225; 31 -1.25,3.225; 32 -1.75,3.225
SOT95P270X145-5N = smd 1.4 x 0.6: 1 -1.25,0.95; 2 -1.25,0; 3 -1.25,-0.95; 4 1.25,-0.95; 5 1.25,0.95
473461001 = smd 0.45 x 1.38: 1 -1.3,1.903; 2 -0.65,1.903; 3 0,1.903; 4 0.65,1.903; 5 1.3,1.903 | smd 1.425 x 2.1: 6 2.487,1.544; 7 -2.487,1.544 | smd 1.8 x 1.9: 8 -1.15,-0.756 | smd 1 x 1.9: 9 1.55,-0.756 | smd 1.65 x 1.3: 10 -3.375,-0.756; 11 3.375,-0.756
JST_B2B-PH-K-S(LF)(SN) = drill 0.86 square: 1 1,-0.55 | drill 0.86: 2 -1,-0.55
SJ3524SMTTRGR = smd 2.2 x 2.8: 1 -4.85,-3.7; 3 -2.85,3.7 | smd 2.8 x 2.8: 2 4.55,-3.7; 4 8.45,0.75 | hole 1.7: -3.75,0; 3.25,0
SMD3528_1 = smd 1.5 x 0.9: 1 -1.55,-0.85; 2 -1.55,0.85; 3 1.55,-0.85; 4 1.55,0.85
LEDC1608X45N = smd 0.8 x 0.95: 1 -0.8,0; 2 0.8,0
SOT95P240X115-3N = smd 1.1 x 0.6: 1 -1.1,0.95; 2 -1.1,-0.95; 3 1.1,0
SOT95P230X110-3N = smd 1.05 x 0.6: 1 -1.1,0.95; 2 -1.1,-0.95; 3 1.1,0
BC33740TA = drill 0.96 pad 1.493: 1 -1.7,-0.585; 2 0.9,-0.585; 3 3.5,-0.585
RESC1608X55N = smd 0.9 x 0.95: 1 -0.8,0; 2 0.8,0
CAPC1608X55N = smd 0.74 x 0.94: 1 -0.74,0; 2 0.74,0
RESC1005X40N = smd 0.75 x 0.6: 1 -0.55,0; 2 0.55,0
RESC1608X50N = smd 0.85 x 1: 1 -0.75,0; 2 0.75,0
RESC2012X64N = smd 0.93 x 1.42: 1 -0.979,0; 2 0.979,0
RESC2012X60N = smd 0.9 x 1.45: 1 -0.95,0; 2 0.95,0
RESC2012X50N = smd 0.92 x 1.42: 1 -1,0; 2 1,0
RESC3216X70N = smd 1.23 x 1.77: 1 -1.466,0; 2 1.466,0
15712943 = smd 2.2 x 1: 1 -5,2; 2 5,2; 3 -5,-2; 4 5,-2
AS11CH = drill 0.8 pad 1.3: 1 0,0; 2 2.54,0; 3 5.08,0; MH1 0,-5.08; MH2 5.08,-5.08

### Placement (x,y rotation side)
C1  74.17,48.9 0 bottom
C2  22.61,30.99 90 top
C3  41.4,40.64 270 top
C4  19.56,11.68 0 top
C5  34.54,11.68 180 top
C6  74.17,51.18 0 bottom
C7  10.16,24.77 90 top
C8  69.22,21.72 180 top
C9  19.18,30.99 90 top
C10  61.09,27.05 180 top
C11  32.64,14.99 0 top
C12  73.03,25.27 180 top
C13  47.62,2.92 270 top
C14  53.47,2.92 270 top
C15  69.22,25.27 180 top
C16  61.09,30.35 180 top
C17  69.22,28.83 0 top
C18  55.24,22.23 90 top
C19  73.03,21.72 180 top
C20  44.83,18.92 180 top
C21  60.58,10.03 180 top
C22  13.72,40.64 0 top
C23  16.76,49.4 270 top
C24  64.39,10.03 180 top
C26  50.16,5.46 0 top
C27  56.01,5.46 0 top
C28  47.62,8 270 top
C29  53.47,8 270 top
D1  12.45,14.99 270 top
D2  10.67,14.99 270 top
D3  8.89,14.99 270 top
D4  10.16,20.32 270 top
D5  23.88,18.54 0 top
ESP32  61.98,42.55 270 top
IC2  16.38,15.75 270 top
IC3  29.21,31.24 0 top
IC4  62.36,18.67 90 top
IC5  12.45,49.15 180 top
J1  3.17,17.78 270 top
J2  3.43,27.18 90 bottom
J3  78.36,13.08 180 top
LED1  36.32,18.8 270 top
LED2  8,50.04 0 top
Q1  29.34,44.58 0 top
Q2  29.34,40.26 0 top
Q3  8.89,40.64 0 top
Q4  8.89,34.29 0 top
R1  42.16,50.8 180 top
R2  42.42,47.24 180 top
R3  27.43,24.51 180 top
R4  21.72,42.29 90 top
R5  25.15,42.29 270 top
R6  45.21,41.91 270 top
R7  26.67,26.42 180 top
R8  19.94,24.51 0 top
R9  14.61,44.07 90 top
R10  16.38,24.51 0 top
R11  41.4,33.02 180 top
R12  41.4,36.83 180 top
R13  40.13,21.34 90 top
R14  32.13,21.21 90 top
R15  16.51,33.78 0 top
R16  2.54,34.29 90 top
R17  65.79,22.86 90 top
R18  3.43,40.51 90 top
R19  7.24,45.97 270 top
R26  44.83,22.73 180 top
R27  47.12,38.23 180 top
R28  47.12,34.42 180 top
R29  47.12,30.61 180 top
R30  47.12,26.8 180 top
R31  44.83,15.37 180 top
R32  44.32,6.73 270 top
R33  49.66,12.32 270 top
R34  53.47,12.32 270 top
R35  62.1,2.92 90 top
R36  58.55,2.92 90 top
R37  44.83,11.81 180 top
S1  19.56,5.08 0 top
S2  34.54,5.08 0 top
S3  10.16,8.38 270 top

### Tracks (layer width: path | path; a pad name or v marks a point on that pad's centre or on a via)
+3V3  (via drill 0.35)
  Top 0.254: 67.82,18.41 IC4.12 | IC3.6 26.86,29.97 IC3.7
  Top 0.381: C8.1 70.02,20.61 67.82,18.41 | IC4.23 61.11,23.09 v60.33,23.88
  Top 0.508: 25.88,27.15 25.88,29.21 v25.72,29.37 26.32,29.97 26.86,29.97 | 25.88,27.15 25.88,26.51 R7.2 | 25.88,27.15 25.72,27.15 22.7,30.16 C2.1 22.7,29.84 21.91,29.05 v21.75,29.05 | 23.21,14.92 17.78,14.92 17.46,14.61 IC2.5 | 23.21,14.92 31.75,14.92 C11.1 | 19.05,29.05 19.05,30 C9.1 | 23.21,14.92 23.21,20.7 22,21.91 14.41,21.91 13.37,22.95 13.37,25.15 17.27,29.05 19.05,29.05 | 19.05,29.05 v19.84,29.05 | 46.2,31.59 46.2,32.26 44.77,33.69 44.77,37.59 45.4,38.23 R27.2 46.58,38.49 46.58,42.26 46.19,42.65 R6.1 45.09,42.86 43.47,44.48 37.47,44.48 34.92,41.94 v34.92,38.1 | 46.2,31.59 46.2,30.64 R29.2 | C8.1 70.01,21.75 70.01,25.24 C15.1 70.17,25.4 v70.17,26.67 | C10.1 61.91,27.15 61.91,30.32 C16.1 62.07,30.48 v63.18,31.59 46.2,31.59 | v69.06,49.21 69.06,50.96 ESP32.2 69.09,51.07 v69.09,52.58 | v56.64,27.18 58.29,28.83 v59.44,28.83 | v62.99,28.07 61.98,27.05 C10.1 | C10.1 v65.79,27.05 | R17.2 v65.79,24.51
  Bottom 0.508: v19.84,29.05 v21.75,29.05 | v69.06,49.21 69.06,37.47 64.21,32.62 | v63.18,31.59 64.21,32.62 | 64.21,32.62 v70.17,26.67 | v34.92,38.1 34.67,38.1 25.94,29.37 v25.72,29.37 | v60.33,23.88 59.94,23.88 v56.64,27.18 | v59.44,28.83 62.23,28.83 v62.99,28.07 | v65.79,27.05 v65.79,24.51 | C1.1 74.97,51.13 C6.1 74.92,51.97 74.31,52.58 v69.09,52.58
+5V
  Top 0.508: D5.1 20.32,18.41 18.92,17.02 17.35,17.02 IC2.1 17.3,17.3 17.3,18 16.43,18.88 13.67,18.88 | C7.1 10.16,22.23 | 10.16,22.23 D4.1 | 13.67,18.88 10.32,22.23 10.16,22.23 | 13.67,18.88 15.4,17.14 IC2.3
+5V/1  (via drill 0.35)
  Top 0.381: J1.1 7.81,19.08 8.1,19.37
  Top 0.508: Q3.2 7.78,37.85 3.48,33.55 R16.1 2.54,31.88 1.36,30.7 1.36,24.42 2.54,23.24 6.73,23.24 8.1,21.88 8.1,19.37 10,19.37 D4.2 | D1.1 12.38,15.56 12.38,16.83 10.16,19.05 D4.2 | v14.92,23.65 15.72,24.45 R10.1 | v10.95,19.68 10.32,19.05 D4.2
  Bottom 0.508: v10.95,19.68 v14.92,23.65
ADS_DRDY  (via drill 0.35)
  Top 0.152: v61.59,24.45 61.59,21.91 IC4.22 | v55.09,36.61 55.09,34.13 ESP32.26
  Bottom 0.152: v61.59,24.45 55.09,30.96 v55.09,36.61
ADS_PWDN  (via drill 0.35)
  Top 0.152: v62.71,20.51 63.72,20.51 64.23,20 65.56,20 IC4.15 | v53.82,35.72 53.82,36.04 53.02,36.83 ESP32.24
  Bottom 0.152: v62.71,20.51 62.71,22.38 53.82,31.27 v53.82,35.72
ADS_START  (via drill 0.35)
  Top 0.152: v32.07,40.16 30.48,40.16 Q2.3 | ESP32.25 52.63,34.05 v51.47,35.21 | v65.56,21.11 65.56,20.48 IC4.16 | S2.4 39.51,3.05 36.83,3.05 35.34,4.53 C5.1 v36.83,11.68 | v53.21,30.23 50.67,27.69 v49.66,27.69
  Bottom 0.152: v32.07,40.16 38.67,40.16 43.62,35.21 v51.47,35.21 51.47,31.91 53.15,30.23 v53.21,30.23 53.85,29.59 53.85,28.38 63.12,19.11 64.39,19.11 65.56,20.29 v65.56,21.11 | v49.66,27.69 49.66,24.51 v36.83,11.68
BAT+  (via drill 0.35)
  Top 0.508: 15.24,50.16 16.67,50.16 C23.1 | 15.24,50.16 13.81,50.16 IC5.3 | v39.12,36.83 R12.2 | v15.24,49.85 15.24,50.16
  Bottom 0.508: v39.12,36.83 37.81,36.83 35.37,39.27 34.67,39.27 27.46,32.07 15.24,32.07 | 15.24,32.07 6.83,32.07 6.03,31.27 | 6.03,31.27 3.02,28.26 J2.1 | 15.24,32.07 v15.24,49.85 | 6.03,31.27 6.7,30.61 6.7,11.46 7.87,10.29 7.87,4.7 9.27,3.3 S3.3
CLKSEL
  Top 0.152: IC4.14 65.59,19.43 66.55,19.43 66.67,19.56 66.67,21.23 R17.1
DTR
  Top 0.152: 27.78,39.37 28.1,39.37 Q2.2 27.78,39.37 | 27.78,39.37 24.38,39.37 22.32,41.43 21.75,41.43 R4.1 | 27.78,39.37 27.78,33.66 IC3.28
EN  (via drill 0.35)
  Top 0.152: C4.1 18.89,11.59 18.89,10.67 19.37,10.19 v20.51,10.19 20.51,4.38 21.84,3.05 24.53,3.05 S1.4 | 43.34,41.27 41.59,41.27 41.43,41.43 C3.1 41.27,41.59 v39.69,43.18 | 43.34,41.27 45.09,41.27 R6.2 | Q1.3 30.48,44.61 33.81,44.61 v36.04,46.83 36.04,48.23 40.64,52.83 67.22,52.83 67.79,52.26 67.79,51.12 ESP32.3 | 43.34,41.27 v43.34,33.66
  Bottom 0.152: v36.04,46.83 v39.69,43.18 | v43.34,33.66 43.34,33.02 v20.51,10.19
EN_CHARGE  (via drill 0.35)
  Top 0.152: v18.41,33.81 17.3,33.81 R15.2 | v55.72,37.4 57.53,37.4 60.17,34.77 60.17,34.13 ESP32.30
  Bottom 0.152: v18.41,33.81 20.51,33.81 28.61,41.91 37.4,41.91 41.91,37.4 v55.72,37.4
G
  Top 0.152: R32.2 45.22,5.98 45.88,6.64 45.88,9.05 48.96,12.13 54.93,12.13 59.02,8.03 66.29,8.03 67.37,9.11 67.37,14.19 72.36,19.18 75.95,19.18 76.04,19.18 80.81,19.18 J3.1
GND  (via drill 0.35)  (1 unrouted)
  Top 0.254: 67.56,18.92 IC4.13 | 68.88,17.41 65.6,17.41 IC4.10
  Top 0.381: C8.2 68.42,19.77 67.56,18.92 | IC3.29 28.71,31.74 IC3.3 24.52,31.74 24.27,32 23.63,32 23.62,32 22.82,32 C2.2 | C19.2 72.23,20.76 68.88,17.41 | 59.72,23.02 60.57,22.17 60.57,21.89
  Top 0.508: ESP32.46 61.12,43.5 61.12,41.75 ESP32.47 61.28,41.75 62.87,41.75 ESP32.44 63.02,41.75 64.61,41.75 ESP32.41 | ESP32.45 61.12,45.24 61.12,43.66 ESP32.46 | ESP32.43 62.87,43.5 61.28,43.5 ESP32.46 | ESP32.45 61.28,45.4 62.87,45.4 ESP32.42 63.02,45.4 64.61,45.4 ESP32.39 | ESP32.41 64.77,41.91 64.77,43.5 ESP32.40 64.93,43.66 70.33,49.05 70.33,50.96 ESP32.1 v71.75,51.05 | ESP32.15 57.94,48.26 60.8,45.4 ESP32.45 | 41.27,39.85 C3.2 41.36,39.88 38.99,39.88 37.94,38.83 37.94,35.72 40.48,33.18 R11.2 | 43.34,30.32 R11.2 | 43.34,30.32 46.2,27.46 46.2,26.83 R30.2 46.51,26.67 50.01,23.18 55.09,23.18 C18.2 55.24,23.02 58.93,23.02 | v46.35,33.34 46.35,34.29 R28.2 | v43.5,30.48 43.34,30.32 | 60.48,25.24 60.48,26.83 60.33,26.99 C10.2 60.33,27.15 60.33,30.32 C16.2 | 58.93,23.02 59.72,23.02 | C8.2 68.42,21.75 68.42,25.24 C15.2 | C19.2 72.23,21.75 72.23,25.24 C12.2 72.07,25.4 72.07,26.99 70.33,28.73 C17.2 | C17.2 70.17,28.89 70.17,33.81 70.33,33.97 ESP32.38 70.33,34.29 70.33,34.92 64.93,40.32 64.93,41.59 ESP32.41 | 68.58,25.4 68.58,26.48 70.43,28.33 C17.2 | 68.58,25.4 C15.2 | 68.26,25.24 C15.2 | J1.5 4.92,16.35 4.92,15.56 4.76,15.4 J1.6 5.08,15.4 7.3,15.4 8.1,14.61 8.73,14.61 D3.2 10.64,14.45 D2.2 10.79,14.45 12.38,14.45 D1.2 12.7,14.45 14.61,14.45 | 14.61,14.45 15.4,14.45 IC2.4 | IC2.4 15.43,14.99 16.35,15.91 16.35,16.99 IC2.2 | IC2.4 15.43,13.59 15.81,13.21 19.81,13.21 20.32,12.7 20.32,11.75 C4.2 20.48,11.59 33.18,11.59 33.34,11.43 | 14.61,14.45 14.61,7.14 S1.1 | 34.45,16.03 35.56,17.14 LED1.3 35.72,17.3 37.15,17.3 LED1.4 | 34.45,16.03 33.5,15.08 C11.2 33.66,14.92 33.66,11.75 C5.2 33.5,11.59 33.34,11.43
  Top 0.508: 33.34,11.43 29.69,7.78 29.69,7.14 S2.1 | 7.14,25.56 3.49,25.56 3.02,26.04 J2.2 | 7.14,25.56 10.16,25.56 C7.2 | 7.14,25.56 7.14,31.91 | 7.14,31.91 7.14,33.66 Q4.1 | IC5.2 13.81,49.05 16.76,49.05 C23.2 16.76,43.81 16.22,43.27 R9.1 14.61,40.64 C22.2 14.99,40.64 20.95,34.67 20.95,31.75 | 20.95,31.75 19.21,31.75 C9.2 19.05,31.91 7.14,31.91 | 20.95,31.75 22.54,31.75 C2.2 | 26.04,24.61 20.8,24.61 R8.2 20.95,24.77 20.95,31.75 | 26.04,24.61 26.67,24.61 R3.2 | 28.51,21.97 26.04,24.45 26.04,24.61 | R11.2 39.56,33.02 28.51,21.97 | 58.93,23.02 58.93,23.69 60.48,25.24 | 34.45,16.03 32.96,17.53 31.24,17.53 29.84,18.92 29.84,20.64 28.51,21.97 | 60.48,25.24 60.52,25.27 64.9,25.27 65.28,25.65 66.29,25.65 66.67,25.27 68.45,25.27 68.58,25.4
  Bottom 0.508: v43.5,30.48 v46.35,33.34 | v71.75,51.05 73.29,51.05 | 73.29,51.05 C6.2 | C1.2 73.37,50.98 73.29,51.05
GREENLED  (via drill 0.35)
  Top 0.152: v40.16,25.56 40.16,22.38 R13.2 | v49.31,34.32 49.69,34.7 49.69,49.24 52.97,52.53 56.19,52.53 56.42,52.3 ESP32.12
  Bottom 0.152: v49.31,34.32 48.93,34.32 v40.16,25.56
L
  Top 0.152: C14.2 53.5,2.22 58.42,2.22 R36.1 59.78,2.12 60.33,2.67 60.33,4.19 61.59,5.46 68.07,5.46 72.79,10.18 72.79,13.5 73.81,14.53 J3.2
N$1
  Top 0.152: R13.1 40.01,20.32 37.31,20.32 LED1.2
N$2
  Top 0.152: R14.1 32.23,20.32 35.4,20.32 LED1.1
N$3
  Top 0.152: C12.1 73.82,25.24 73.82,21.75 C19.1 73.81,21.24 69.56,16.99 65.72,16.99 IC4.9
N$4
  Top 0.152: R4.2 21.75,43.18 22.61,43.18 24.83,45.4 28.1,45.4 Q1.1
N$5
  Top 0.152: R5.2 25.24,41.43 27.94,41.43 28.1,41.27 Q2.1
N$6  (via drill 0.35)
  Top 0.152: IC4.11 65.6,17.94 68.39,17.94 v68.52,18.07 | v66.99,27.46 68.26,28.73 C17.1
  Bottom 0.152: v66.99,27.46 66.99,19.59 v68.52,18.07
N$7
  Top 0.152: IC4.27 56.08,19.42 55.24,20.26 C18.1
N$8
  Top 0.152: LED2.1 7.14,50.01 7.14,46.99 R19.1
N$9
  Top 0.152: IC4.32 59.1,16.95 57.75,16.95 54.61,13.81 53.5,13.81 R34.1
N$10  (via drill 0.35)
  Top 0.152: v25.56,17.78 26.67,17.78 27.3,18.41 D5.2
  Bottom 0.152: v25.56,17.78 16.19,8.41 10.16,8.41 S3.1
N$11
  Top 0.152: IC5.5 11.2,46.43 12.76,44.87 R9.2
N$12
  Top 0.152: R15.1 15.72,33.81 12.54,33.81 Q4.3
N$13
  Top 0.152: IC4.31 59.12,17.43 57.75,17.43 56.1,15.78 50.26,15.78 49.66,15.18 R33.1
N$14
  Top 0.152: R18.1 3.49,39.69 6.13,39.69 7.14,40.7 8.41,40.7 9.14,39.97 9.14,38.73 9.68,38.2 9.68,33.81 Q4.2
N$15
  Top 0.152: C29.1 53.5,8.89 53.5,10.79 R34.2
N$16
  Top 0.152: IC3.11 29.21,27.78 28.26,26.83 28.26,24.61 R3.1
N$17
  Top 0.152: IC3.9 28.23,28.88 28.23,27.88 27.62,27.27 27.62,26.51 R7.1
N$18  (via drill 0.35)
  Top 0.152: R10.2 16.99,24.61 19.05,24.61 R8.1 19.21,24.61 v20.16,25.56 | v26.67,28.73 27.62,28.73 IC3.8
  Bottom 0.152: v26.67,28.73 23.34,28.73 v20.16,25.56
N$19  (via drill 3)
  other vias: 4.06,49.91
N$20
  Top 0.152: C14.1 53.5,3.81 55.09,5.4 C27.1 55.09,5.56 53.5,7.14 C29.2
N$21
  Top 0.152: C13.1 47.62,3.81 49.21,5.4 C26.1 49.21,5.56 47.62,7.14 C28.2
N$22
  Top 0.152: C28.1 47.62,8.89 49.53,10.79 R33.2
N$23  (via drill 0.35)
  Top 0.152: v58.58,7.3 58.58,3.81 R36.2 | v62.39,14.13 62.39,14.45 62.55,14.61 62.55,15.4 IC4.5
  Bottom 0.152: v58.58,7.3 62.39,11.11 v62.39,14.13
N$24  (via drill 0.35)
  Top 0.152: v63.18,3.81 62.23,3.81 R35.2 | v63.02,13.34 63.02,15.4 IC4.6
  Bottom 0.152: v63.18,3.81 63.18,13.18 v63.02,13.34
N$25
  Top 0.152: R16.2 2.41,35.16 2.41,35.66 1.49,36.59 1.49,40.87 2.09,41.46 R18.2 3.49,41.59 Q3.1
N$26
  Top 0.152: R19.2 8.62,44.97 9.05,45.4 9.05,48.1 10.06,49.12 12.06,49.12 12.92,48.26 13.65,48.26 IC5.1
N$27
  Top 0.152: R26.2 44.13,22.7 44.13,19.05 C20.2 44.13,18.89 44.13,15.4 R31.2 44.13,15.24 44.13,11.91 R37.2 44.13,11.75 44.29,11.59 44.29,7.62 R32.1
N$28
  Top 0.152: IC5.4 11.11,50.01 8.89,50.01 LED2.2 8.73,50.01 8.73,46.2 8.51,45.97 6.1,45.97 5.81,45.69 5.81,44.1 6.22,43.69 9.14,43.69 9.99,42.84 Q3.3 C22.1
N$29  (via drill 3)
  other vias: 81.66,49.91
N$30  (via drill 3)
  other vias: 81.66,4.06
N$42
  Top 0.152: IC4.2 61.12,15.4 61.12,10.48 61.44,10.16 C21.1
N$44
  Top 0.152: IC4.1 60.61,10.92 59.85,10.16 C21.2
N$46  (via drill 0.35)
  Top 0.152: R29.1 47.94,30.48 47.94,26.83 R30.1 47.94,26.67 v53.18,26.67 | v61.75,11.43 61.59,11.59 61.59,15.4 IC4.3 | v57.15,6.83 57.15,5.87 56.83,5.56 C27.2
  Bottom 0.152: v57.15,6.83 v61.75,11.43 61.75,14.45 62.71,15.4 62.71,17.14 v53.18,26.67
N$47  (via drill 0.35)
  Top 0.152: R27.1 47.94,38.1 47.94,34.45 R28.1 47.94,34.29 v47.94,32.38 | v62.07,16.83 62.07,15.56 IC4.4 | v51.91,6.67 51.91,6.35 51.12,5.56 C26.2
  Bottom 0.152: v51.91,6.67 v62.07,16.83 47.94,30.96 v47.94,32.38
N$48
  Top 0.152: IC4.8 64.14,15.4 64.14,11.27 65.25,10.16 C24.1
N$49
  Top 0.152: IC4.7 63.66,15.4 63.66,10.16 C24.2
N$56
  Top 0.152: IC4.29 59.05,18.41 58.26,18.41 55.93,16.09 50.13,16.09 49.42,15.37 R31.1
N$57
  Top 0.152: R37.1 46.25,12.48 55.98,12.48 60.17,16.67 60.17,17.62 59.85,17.94 59.21,17.94 IC4.30
N$59
  Top 0.152: R26.1 45.72,22.7 45.72,19.05 C20.1 45.72,18.89 59.05,18.89 IC4.28
R
  Top 0.152: C13.2 47.62,2.06 48.55,1.14 61.47,1.14 62.1,1.78 R35.1 62.23,2.22 69.63,2.22 76.79,9.38 J3.3
REDLED  (via drill 0.35)
  Top 0.152: R14.2 33.88,22.19 38.48,26.8 42.16,26.8 43.94,25.02 47.37,25.02 50.16,22.23 58.83,22.23 60.33,20.73 60.33,19.53 60.64,19.21 62.64,19.21 63.18,19.75 v63.44,19.75 | v58.86,48.67 57.69,49.85 ESP32.11
  Bottom 0.152: v63.44,19.75 63.56,19.75 64.77,20.95 64.77,29.08 58.86,34.99 v58.86,48.67
RTS  (via drill 0.35)
  Top 0.152: R5.1 25.16,43.05 27.65,43.05 28.1,43.5 Q1.2 29.69,42.18 v29.69,41.27 | v29.69,35.4 29.69,33.66 IC3.24
  Bottom 0.152: v29.69,41.27 v29.69,35.4
RXD
  Top 0.152: IC3.25 29.21,34.13 29.05,34.29 29.05,35.72 33.02,39.69 33.02,40.8 39.37,47.15 41.59,47.15 R2.2
RXD0  (via drill 0.35)
  Top 0.152: v48.42,45.4 43.02,50.8 R1.1 | v56.67,39.81 61.21,39.81 65.25,35.78 65.25,34.13 ESP32.34
  Bottom 0.152: v56.67,39.81 56.67,42.35 53.63,45.4 v48.42,45.4
SENSOR_VN  (via drill 0.35)
  Top 0.152: 42.23,36.83 42.23,33.02 R11.1 | v65.25,49.37 65.25,50.96 ESP32.5 | v42.7,38.58 42.7,37.31 42.23,36.83 | 42.23,36.83 R12.1
  Bottom 0.152: v65.25,49.37 56.2,49.37 55.56,50.01 51.91,50.01 42.7,40.8 v42.7,38.58
SPI_CS0  (via drill 0.35)
  Top 0.152: v63.66,23.5 63.66,21.91 IC4.18 | v56.74,38.73 56.1,38.1 ESP32.23
  Bottom 0.152: v63.66,23.5 56.74,30.42 v56.74,38.73
SPI_MISO  (via drill 0.35)
  Top 0.152: v60.96,19.84 62.07,20.95 62.07,21.75 IC4.21 | v48.9,32.38 48.96,32.38 50.64,34.07 50.64,48.96 52.72,51.04 52.72,51.05 ESP32.14
  Bottom 0.152: v60.96,19.84 60.96,20.32 v48.9,32.38
SPI_MOSI  (via drill 0.35)
  Top 0.152: IC4.19 63.02,21.98 63.02,23.81 v63.66,24.45 | v54.45,46.04 53.5,46.99 ESP32.16
  Bottom 0.152: v63.66,24.45 63.66,28.92 57.44,35.15 57.44,43.05 v54.45,46.04
SPI_SCK  (via drill 0.35)
  Top 0.152: IC4.20 62.61,21.9 62.55,21.96 62.55,23.5 v62.39,23.65 | v55.24,49.37 55.24,50.96 ESP32.13
  Bottom 0.152: v62.39,23.65 63.18,22.86 63.98,22.86 64.29,23.18 64.29,28.89 57.88,35.31 57.88,46.74 v55.24,49.37
TXD
  Top 0.152: R1.2 41.27,50.8 41.27,49.53 32.7,40.96 32.7,39.85 28.73,35.88 28.73,33.66 IC3.26
TXD0  (via drill 0.35)
  Top 0.152: v48.42,42.07 43.34,47.15 R2.1 | v55.47,40.58 61.47,40.58 66.52,35.53 66.52,34.13 ESP32.35
  Bottom 0.152: v48.42,42.07 53.98,42.07 v55.47,40.58
USB_DN  (via drill 0.35)
  Top 0.152: J1.2 5.08,18.41 7.46,18.41 10.32,15.56 10.64,15.56 D2.1 10.79,15.56 v10.79,17.14 | v25.4,30.64 25.56,30.8 26.83,30.8 IC3.5
  Bottom 0.152: v25.4,30.64 24.29,30.64 v10.79,17.14
USB_DP  (via drill 0.35)
  Top 0.152: D3.1 8.72,15.54 7.62,16.64 v7.62,17.27 7.11,17.78 J1.3 | v23.97,31.27 26.83,31.27 IC3.4
  Bottom 0.152: v23.97,31.27 19.97,31.27 7.62,18.92 v7.62,17.27

### Text on the board
_tsilk: ECG / Karl Stein